# EAGLE schematic Esp32_Shield V3 no LED (EAGLE 9.6.2)
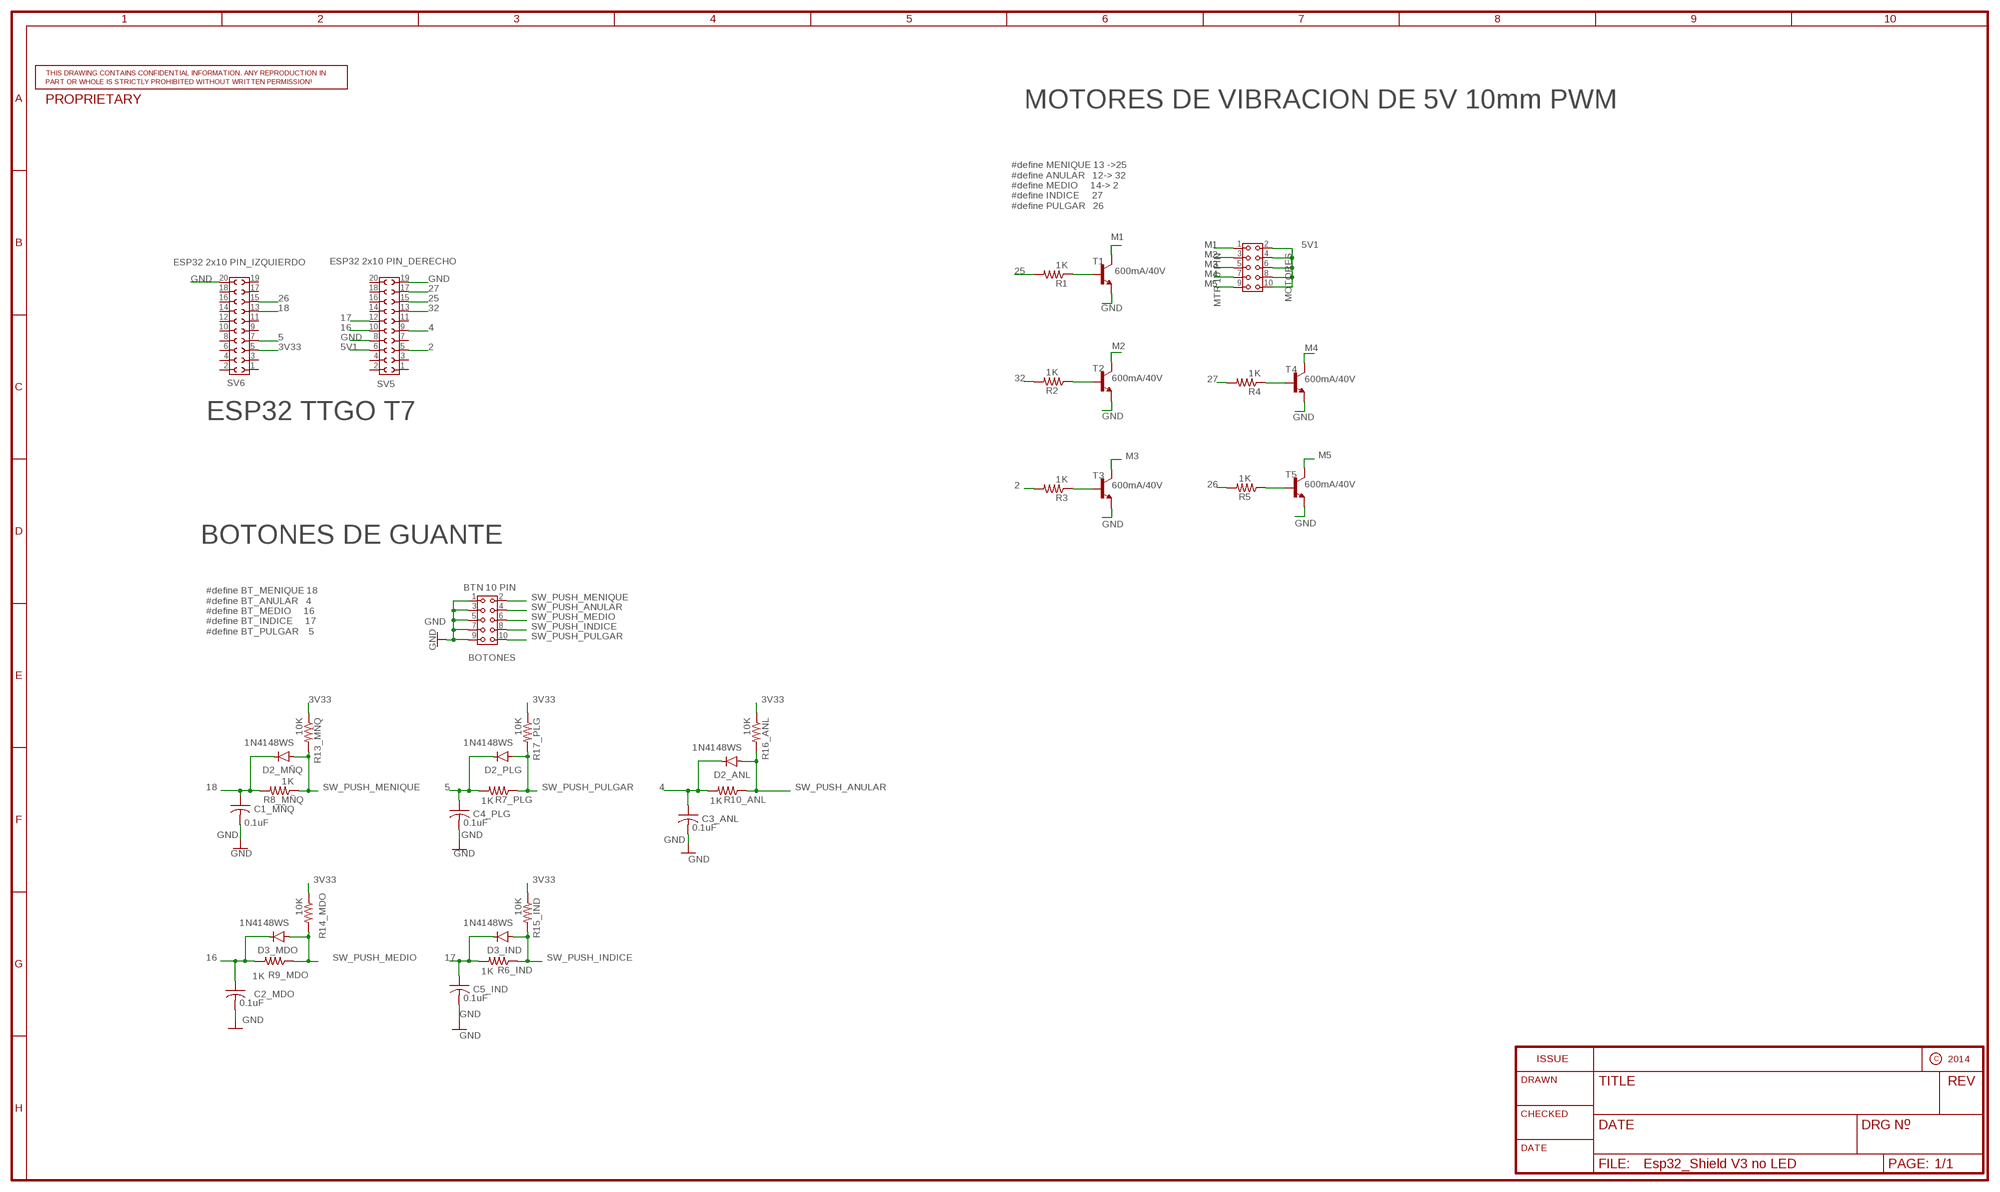
[diagram p0: schematic, sheet 1]

## Parts
BOTONES  BTN 10 PIN  6130XX21821_61301021821  [61301021821]
C1_MÑQ  0.1uF  C-USC0805  [C0805]
C2_MDO  0.1uF  C-USC0805  [C0805]
C3_ANL  0.1uF  C-USC0805  [C0805]
C4_PLG  0.1uF  C-USC0805  [C0805]
C5_IND  0.1uF  C-USC0805  [C0805]
D2_ANL  1N4148WS  [SOD-323]
D2_MÑQ  1N4148WS  [SOD-323]
D2_PLG  1N4148WS  [SOD-323]
D3_IND  1N4148WS  [SOD-323]
D3_MDO  1N4148WS  [SOD-323]
MOTORES  MTR 10 PIN  6130XX21821_61301021821  [61301021821]
R1  1K  R-US_R0805  [R0805]
R2  1K  R-US_R0805  [R0805]
R3  1K  R-US_R0805  [R0805]
R4  1K  R-US_R0805  [R0805]
R5  1K  R-US_R0805  [R0805]
R6_IND  1K  R-US_R0805  [R0805]
R7_PLG  1K  R-US_R0805  [R0805]
R8_MÑQ  1K  R-US_R0805  [R0805]
R9_MDO  1K  R-US_R0805  [R0805]
R10_ANL  1K  R-US_R0805  [R0805]
R13_MÑQ  10K  R-US_R0805  [R0805]
R14_MDO  10K  R-US_R0805  [R0805]
R15_IND  10K  R-US_R0805  [R0805]
R16_ANL  10K  R-US_R0805  [R0805]
R17_PLG  10K  R-US_R0805  [R0805]
SV5  ESP32 2x10 PIN_DERECHO  6130XX21821_61302021821  [61302021821]
SV6  ESP32 2x10 PIN_IZQUIERDO  6130XX21821_61302021821  [61302021821]
T1  600mA/40V  TRANS_NPN-MMBT2222AL  [SOT23-3]
T2  600mA/40V  TRANS_NPN-MMBT2222AL  [SOT23-3]
T3  600mA/40V  TRANS_NPN-MMBT2222AL  [SOT23-3]
T4  600mA/40V  TRANS_NPN-MMBT2222AL  [SOT23-3]
T5  600mA/40V  TRANS_NPN-MMBT2222AL  [SOT23-3]

## Nets
2: R3.2 SV5.5
3V33: R13_MÑQ.1 R14_MDO.1 R15_IND.1 R16_ANL.1 R17_PLG.1 SV6.5
4: C3_ANL.1 D2_ANL.C R10_ANL.2 SV5.9
5: C4_PLG.1 D2_PLG.C R7_PLG.2 SV6.7
5V1: MOTORES.2 MOTORES.4 MOTORES.6 MOTORES.8 MOTORES.10 SV5.6
16: C2_MDO.1 D3_MDO.C R9_MDO.2 SV5.10
17: C5_IND.1 D3_IND.C R6_IND.2 SV5.12
18: C1_MÑQ.1 D2_MÑQ.C R8_MÑQ.2 SV6.13
25: R1.2 SV5.15
26: R5.2 SV6.15
27: R4.2 SV5.17
32: R2.2 SV5.13
GND: BOTONES.1 BOTONES.3 BOTONES.5 BOTONES.7 BOTONES.9 C1_MÑQ.2 C2_MDO.2 C3_ANL.2 C4_PLG.2 C5_IND.2 SV5.8 SV5.19 SV6.20 T1.2(E) T2.2(E) T3.2(E) T4.2(E) T5.2(E)
M1: MOTORES.1 T1.3(C)
M2: MOTORES.3 T2.3(C)
M3: MOTORES.5 T3.3(C)
M4: MOTORES.7 T4.3(C)
M5: MOTORES.9 T5.3(C)
N$1: R2.1 T2.1(B)
N$2: R1.1 T1.1(B)
N$3: R3.1 T3.1(B)
N$11: R4.1 T4.1(B)
N$13: R5.1 T5.1(B)
SW_PUSH_ANULAR: BOTONES.4 D2_ANL.A R10_ANL.1 R16_ANL.2
SW_PUSH_INDICE: BOTONES.8 D3_IND.A R6_IND.1 R15_IND.2
SW_PUSH_MEDIO: BOTONES.6 D3_MDO.A R9_MDO.1 R14_MDO.2
SW_PUSH_MENIQUE: BOTONES.2 D2_MÑQ.A R8_MÑQ.1 R13_MÑQ.2
SW_PUSH_PULGAR: BOTONES.10 D2_PLG.A R7_PLG.1 R17_PLG.2
Unconnected: SV5.1 SV5.2 SV5.3 SV5.4 SV5.7 SV5.11 SV5.14 SV5.16 SV5.18 SV5.20 SV6.1 SV6.2 SV6.3 SV6.4 SV6.6 SV6.8 SV6.9 SV6.10 SV6.11 SV6.12 SV6.14 SV6.16 SV6.17 SV6.18 SV6.19

## Notes on the sheet
- MOTORES DE VIBRACION DE 5V 10mm PWM
- #define MENIQUE 13 ->25
  #define ANULAR   12-> 32
  #define MEDIO     14-> 2
  #define INDICE     27
  #define PULGAR   26
- ESP32 TTGO T7
- BOTONES DE GUANTE
- #define BT_MENIQUE 18
  #define BT_ANULAR   4
  #define BT_MEDIO     16
  #define BT_INDICE     17
  #define BT_PULGAR    5

## Library data of the parts
BOTONES MOTORES = Wurth_Connectors_WR-PHD:6130XX21821_61301021821: WR-PHD 2.54 mm Dual Socket Header ARTICLE PROPERTIES: Pins:4;​ 6;​ 8;​ 10;​ 12;​ 14;​ 16;​ 18;​ 20;​ 22;​ 24;​ 26;​ 28;​ 30;​ 32;​ 34;​ 36;​ 40;​ 44;​ 64;​ 72 KIND PROPERTIES: Pitch：2.54 mm Quality Class:3 as per CECC 75 301-802 Rows：Dual Gender：Socket Header Type：Straight MATERIAL PROPERTIES: Insulator Material :PBT Insulator Flammability Rating:UL94 V-0 Contact Material:Copper Alloy Contact Plating:Gold Contact Type:Stamped GENERAL INFORMATION Operating Temperature:-40 up to +125 °C Compliance:Lead free / RoHS ELECTRICAL PROPERTIES: Rated Current:3 A IR 1:3 A Withstanding Voltage:500 V (AC) Contact Resistance:20 mΩ RISO:1000 MΩ CERTIFICATION UL Approval:E323964 PACKAGING PROPERTIES Packaging:Tray <https://katalog.we-online.com/media/images/v2/o57948v209%20Family_Dual_Socket_Header_WR-PHD_6130xx21821.jpg> Details see: https://katalog.we-online.com/en/em/PHD_2_54_DUAL_SOCKET_HEADER_6130XX21821 Updated by Yingchun,Shan 2019-10-21 2019 (C) Würth Elektronik; DATASHEET-URL: https://katalog.we-online.com/em/datasheet/61301021821.pdf; GENDER: Socket Header; IR: 3A; MATES: WR-PHD 2.54mm SMT Dual Pin Header/THT Angled Dual Pin Header/THT Dual Board Stacker/THT Dual Pin Header; PACKAGING: Tray; PART-NUMBER: 61301021821; PINS: 10; ROWS: Dual; TYPE: Straight
C1_MÑQ C2_MDO C3_ANL C4_PLG C5_IND = resistor:C-US: CAPACITOR, American symbol
D2_ANL D2_MÑQ D2_PLG D3_IND D3_MDO = Diodes:1N4148WS: DIODE GEN PURP 75V 150MA SOD323F Manufacturer's datasheet <https://www.onsemi.com/pub/Collateral/1N914BWS-D.pdf>; CREATED_BY: PCBLayout.com; DIGIKEY_PART_NUMBER: 1N4148WSFSTR-ND; MANUFACTURER: Diodes Incorporated; MPN: 1N4148WS; PACKAGE: SOD-323
R1-R5 R6_IND R7_PLG R8_MÑQ R9_MDO R10_ANL R13_MÑQ R14_MDO R15_IND R16_ANL R17_PLG = resistor:R-US_: RESISTOR, American symbol
SV5 SV6 = Wurth_Connectors_WR-PHD:6130XX21821_61302021821: WR-PHD 2.54 mm Dual Socket Header ARTICLE PROPERTIES: Pins:4;​ 6;​ 8;​ 10;​ 12;​ 14;​ 16;​ 18;​ 20;​ 22;​ 24;​ 26;​ 28;​ 30;​ 32;​ 34;​ 36;​ 40;​ 44;​ 64;​ 72 KIND PROPERTIES: Pitch：2.54 mm Quality Class:3 as per CECC 75 301-802 Rows：Dual Gender：Socket Header Type：Straight MATERIAL PROPERTIES: Insulator Material :PBT Insulator Flammability Rating:UL94 V-0 Contact Material:Copper Alloy Contact Plating:Gold Contact Type:Stamped GENERAL INFORMATION Operating Temperature:-40 up to +125 °C Compliance:Lead free / RoHS ELECTRICAL PROPERTIES: Rated Current:3 A IR 1:3 A Withstanding Voltage:500 V (AC) Contact Resistance:20 mΩ RISO:1000 MΩ CERTIFICATION UL Approval:E323964 PACKAGING PROPERTIES Packaging:Tray <https://katalog.we-online.com/media/images/v2/o57948v209%20Family_Dual_Socket_Header_WR-PHD_6130xx21821.jpg> Details see: https://katalog.we-online.com/en/em/PHD_2_54_DUAL_SOCKET_HEADER_6130XX21821 Updated by Yingchun,Shan 2019-10-21 2019 (C) Würth Elektronik; DATASHEET-URL: https://katalog.we-online.com/em/datasheet/61302021821.pdf; GENDER: Socket Header; IR: 3A; MATES: WR-PHD 2.54mm SMT Dual Pin Header/THT Angled Dual Pin Header/THT Dual Board Stacker/THT Dual Pin Header; PACKAGING: Tray; PART-NUMBER: 61302021821; PINS: 20; ROWS: Dual; TYPE: Straight
T1-T5 = SparkFun-DiscreteSemi:TRANS_NPN: NPN transistor Current controlled devices typically used to amplify current or used as a switch. BC547 - COM-08928 <http://www.sparkfun.com/products/8928> (TO-92 45V 100mA) (1.Collector 2.Base 3.Emitter) 2N3904 - COM-00521 <http://www.sparkfun.com/products/521> (TO-92 40V 200mA) (1.Emitter 2.Base 3.Collector) P2N2222A - COM-12852 <http://www.sparkfun.com/products/12852> (TO-92 40V 600mA) (1.Collector 2.Base 3.Emitter); PROD_ID: TRANS-08049